# Altium schematic sheet Power.SchDoc
size A; SheetNumber: 1; SheetTotal: 3
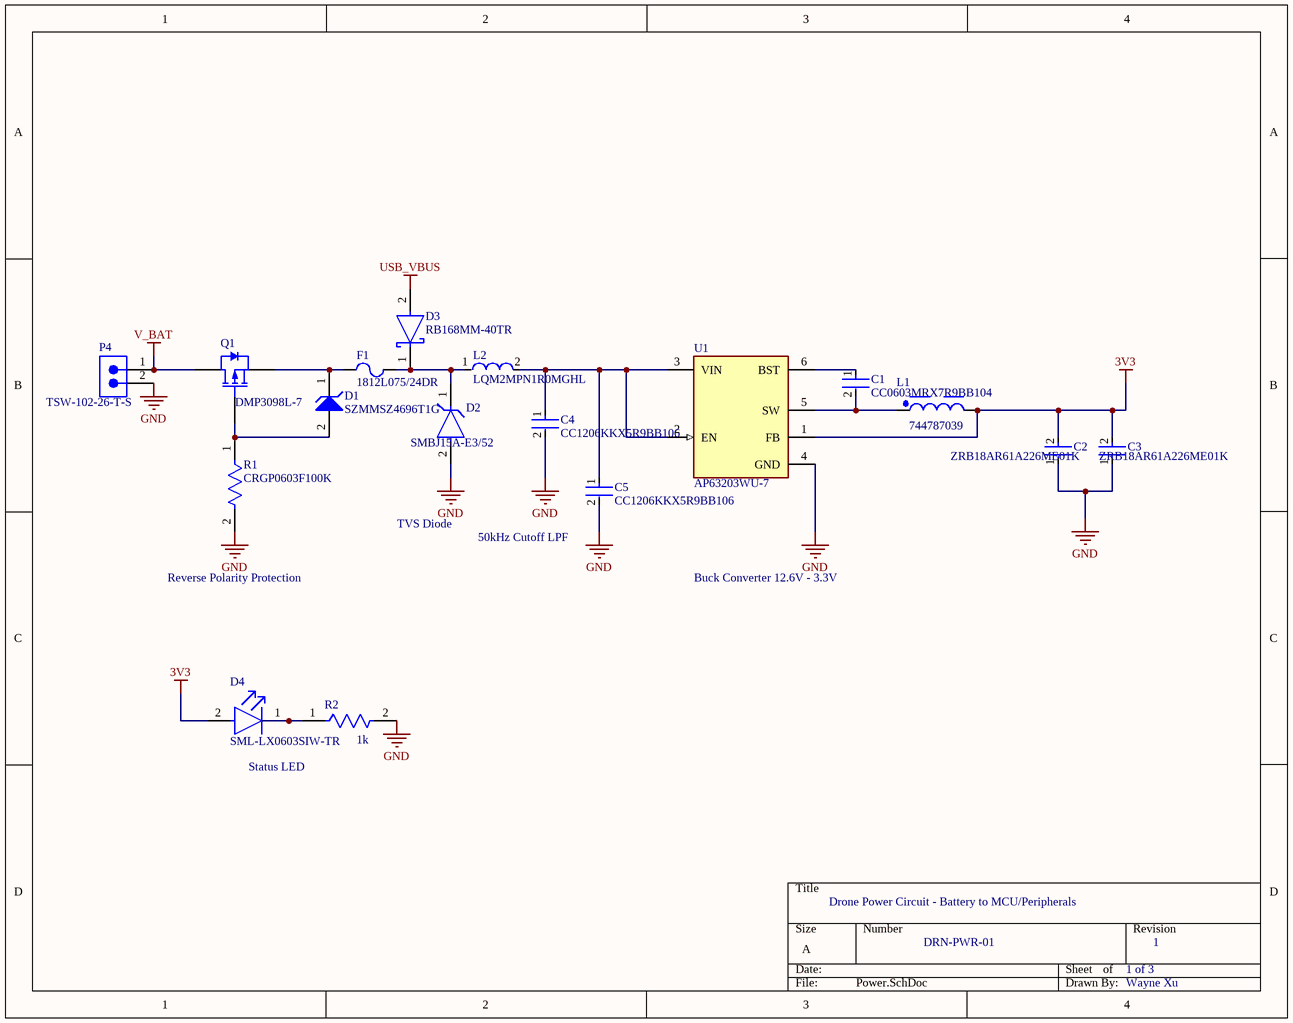
[diagram p0: Power.SchDoc]

## Parts
C1  CC0603MRX7R9BB104  [FP-CC0603-DA-MFG]
C2  ZRB18AR61A226ME01K  [FP-ZRB18A-0_2-MFG]
C3  ZRB18AR61A226ME01K  [FP-ZRB18A-0_2-MFG]
C4  CC1206KKX5R9BB106  [FP-CC1206-FD-MFG]
C5  CC1206KKX5R9BB106  [FP-CC1206-FD-MFG]
D1  SZMMSZ4696T1G  [ONSC-SOD-123-2-425-04_V]
D2  SMBJ15A-E3/52  [FP-95401-MFG]
D3  RB168MM-40TR  [FP-PMDU-MFG]
D4  SML-LX0603SIW-TR  [FP-SML-LX0603SIW-TR-MFG]
F1  1812L075/24DR  [LFUS-1812L07524DR_V]
L1  744787039  [WE-PD2SR_7850]
L2  LQM2MPN1R0MGHL  [FP-LQM2MPN_GH-MFG]
P4  TSW-102-26-T-S  [SMTC-TSW-102-26-XX-S]
Q1  DMP3098L-7  [DIOD-SOT23-3_V]
R1  CRGP0603F100K  [FP-CRGP0603-IPC_C]
R2  1k  [FP-CRGCQ0402-IPC_C]
U1  AP63203WU-7  [FP-TSOT26-MFG]

## Nets
3V3: C2.2 C3.2 D4.2(A) L1.2 U1.1(FB)
GND: C2.1 C3.1 C4.2 C5.2 D2.2(A) P4.2 R1.2 R2.2 U1.4(GND)
USB_VBUS: D3.2(A)
V_BAT: P4.1 Q1.3(D)
NetC1_1: C1.1 U1.6(BST)
NetC1_2: C1.2 L1.1 U1.5(SW)
NetC4_1: C4.1 C5.1 L2.2 U1.2(EN) U1.3(VIN)
NetD1_1: D1.1(K) F1.1 Q1.2(S)
NetD1_2: D1.2(A) Q1.1(G) R1.1
NetD2_1: D2.1(C) D3.1(C) F1.2 L2.1
NetD4_1: D4.1(C) R2.1

## Notes on the sheet
- TVS Diode
- (near C5) 50kHz Cutoff LPF
- Reverse Polarity Protection
- Buck Converter 12.6V - 3.3V
- Status LED
- Drone Power Circuit - Battery to MCU/Peripherals
- DRN-PWR-01
- 1 of 3
- 1
- Wayne Xu

## Library data of the parts
C1 = CMP-03422-000537-1: CAP CER 0.1UF 50V X7R 0603; Manufacturer: YAGEO; Material: Ceramic; Capacitance: 100 nF; Temperature Coefficient: 15%; Tolerance: 0.2; Value: 100 nF; Temperature Range Low: -55°C; Height: 0.9mm; Temperature Range High: +125°C; Category: Cap; Package: CC0603-DA; Mouser Description: Cap Ceramic 50V 20% +Tol 20% -Tol X7R 15% TC 0.1uF SMD 0603; Temperature Characteristic: X7R; Footprint Url: http://www.yageo.com/exep/pages/download/literatures/UPY-C_GEN_24.pdf; Octopart: https://octopart.com/cc0603mrx7r9bb104-yageo-67308423; RoHS: TRUE; Voltage: 50 V; Manufacturer Part Number: CC0603MRX7R9BB104; Lead Free: Yes; ComponentLink2URL: http://www.yageo.com/documents/recent/UPY-GPHC_X7R_6.3V-to-50V_18.pdf; ComponentLink2Description: Datasheet; Digikey Description: CAP CER 0.1UF 50V X7R 0603; Device Class L2: Capacitors; Automotive: No; Voltage Rating: 50 V; Temperature: -55°C to +125°C; Device Class L1: Passive Components; Device Class L3: Ceramic Capacitors
C2 C3 = CMP-06035-026751-1: CAP CER MLCC
C4 C5 = CMP-03422-001420-1: CAP CER 10UF 50V X5R 1206; Tolerance: 10%; Voltage Rating (DC): 50V; Width: 0.063inch; Halogen Free: Halogen Free; Mount: Surface Mount; Dielectric: X5R; Max Operating Temperature: 85°C; Capacitance: 10uF; Case/Package: 1206; Voltage Rating: 50V; Lead Free: Lead Free; Thickness: 0.075inch; Min Operating Temperature: -55°C; Length: 0.126inch; Packaging: Tape and Reel; RoHS Compliant: Yes
D1 = CMP-1060-00433-1: Zener Voltage Regulator, 500 mW, 2-Pin SOD-123, Pb-Free, Tape and Reel; Manufacturer: On Semiconductor; VZ Typ (V): 9.1; P Max (W): 0.5; PartNumber: SZMMSZ4696T1G; PackageVersion: Rev. G, 10/2009; ComponentLink1URL: http://www.onsemi.com/; ComponentLink1Description: Manufacturer URL; PackageDescription: 2-Pin SOD, Body 1.6 x 2.69 mm; ComponentLink2URL: http://www.onsemi.com/pub_link/Collateral/MMSZ4678T1-D.PDF; DatasheetVersion: Rev. 9; Packing: Tape and Reel; PackageReference: SOD-123-2-425-04; ComponentLink3URL: http://www.onsemi.com/pub_link/Collateral/425-04.PDF; ComponentLink2Description: Datasheet; RoHS: Pb-Free; Mounting Technology: Surface Mount; ComponentLink3Description: Package Specification
D2 = CMP-02577-000009-1: TVS DIODE 15V 24.4V DO214AA; Manufacturer: Vishay; Standoff Height: 0mm; Number Of Channels: 1; Max Junction Temp: +150°C; Breakdown Voltage: 16.7V; Peak Pulse Power: 600W; Peak Pulse Current: 24.6A; Direction: Unidirectional; Category: Diode; Reverse Standoff Voltage: 15V; Manufacturer Part Number: SMBJ15A-E3/52; Package: 95401; Temperature: -55°C to +150°C; Automotive: No; ComponentLink2Description: Datasheet; Temperature Range High: +150°C; ComponentLink2URL: https://www.vishay.com/docs/88392/smbj.pdf; Temperature Range Low: -55°C; Digikey Description: TVS DIODE 15V 24.4V DO214AA; Device Class L1: Circuit Protection; Mouser Description: TVS Diodes - Transient Voltage Suppressors 600W 15V 5% Uni; RoHS: TRUE; Device Class L2: TVS Diodes; Footprint Url: https://www.vishay.com/docs/95401/smb.pdf; Clamping Voltage: 24.4V; Octopart: https://octopart.com/smbj15a-e3%2F52-vishay-39558613; Lead Free: Yes; Device Class L3: unset; Height: 2.44mm
D3 = CMP-08971-000002-1: DIODE SCHOTTKY 40V 1A PMDU; Manufacturer: Rohm; Peak Reverse Current: 0.05uA; Max Surge Forward Current: 40A; Max Junction Temp: +150°C; ComponentLink2URL: https://www.rohm.com/datasheet/RB168MM-40/rb168mm-40tr-e; Manufacturer Part Number: RB168MM-40TR; Mouser Description: Schottky Diodes & Rectifiers 40V-VR 1A-IO 30A-IFSM; Reverse Voltage: 40V; Package: PMDU; Forward Current: 1A; Height: 0.9mm; Device Class L1: Discrete Semiconductors; Octopart: https://octopart.com/rb168mm-40tr-rohm-65063949; Digikey Description: DIODE SCHOTTKY 40V 1A PMDU; Lead Free: Yes; Temperature: to +150°C; RoHS: TRUE; Temperature Range High: +150°C; Max Repetitive Reverse Voltage: 40V; Device Class L2: Diodes; Automotive: No; Category: Diode; Device Class L3: Schottky Diodes; ComponentLink2Description: Datasheet
D4 = CMP-57192-000009-1: LED RED DIFFUSED SMD; Test Current: 20mA; Forward Voltage: 2V; Approvals: UL; Dominant Wavelength: 636nm; Viewing Angle: 140°; Lens Color: White; Luminous Intensity: 60mcd; Power Rating: 50mW; Number of LEDs: 1; Color: Red; Forward Current: 20mA; Moisture Sensitivity Level: 2; Case Code (Imperial): 0603; Lead Free: Lead Free; Lens Transparency: Diffused; Case Code (Metric): 1608; Height: 0.6mm; Max Operating Temperature: 85°C; Width: 0.8mm; Lens Style: Diffused; Illumination Color: Red; Wavelength: 636nm; REACH SVHC: No SVHC; Package Quantity: 1; RoHS Compliant: Yes; Case/Package: 0603; Number of Pins: 2; Packaging: Tape and Reel; Length: 1.6mm; Mount: Surface Mount; Min Operating Temperature: -25°C
F1 = CMP-2000-05510-1: Poly-Fuse(R) Resettable PTC, 24 V, 100 A, -40 to 85 degC, 2-Pin SMD, RoHS, Tape and Reel; Manufacturer: Littelfuse; Resistance: 290mOhms; Current Rating - Max: 100A; Maximum Voltage: 24VDC; Hold Current: 0.75A; Trip Current: 1.5A; Maximum Voltage DC: 24V; Type: PolyFuseResettablePTC; Datasheet Version: 02/2016; Package / Case: 1812(4532metric); Mounting Technology: SurfaceMount; Packaging: Reel; Package Description: 2-Pin Surface Mount Device, Body 4.55 x 3.24 mm; Brand: Littelfuse; Manufacturer URL: http://www.littelfuse.com/; Mounting Style: SMD/SMT; Dimensions: 4.37mmLx3.07mmWx0.75mmH; Operating Temperature Range: -40Cto+85C; Product Category: ResettableFuses-PPTC; Current Rating: 100A; Termination Style: SMD/SMT; Factory Pack Quantity: 1500; Current Rating (Max): 100A; Package Reference: 1812L07524DR; RoHS: Details; Series: 1812L; Datasheet URL: http://www.littelfuse.com/~/media/electronics/datasheets/resettable_ptcs/littelfuse_ptc_1812l_datasheet.pdf.pdf
L1 = CMP-1397-00011-3: Fixed Ind 3.9UH 3.8A 20 Mohm SMD; Core Material: Composite, Ferrite; Inductance: 3.9µH; Series Resistance: 16.7mΩ; Tolerance: 30%; Test Frequency: 100kHz; Shielding: Shielded; Self Resonant Frequency: 45MHz; Saturation Current: 4A; Number of Pins: 2; Max Operating Temperature: 125°C; Mount: Surface Mount; Length: 7.8mm; DC Resistance (DCR): 16.7mΩ; Case/Package: SMD/SMT; Min Operating Temperature: -40°C; Width: 7mm; REACH SVHC: Unknown; RMS Current (Irms): 3.8A; Max DC Current: 3.8A; Composition: Wirewound; Termination: SMD/SMT; Inductance Tolerance: 30%; Ambient Temperature Range High: 85°C; Ambient Temperature Range Low: -40°C; Depth: 7mm; Height - Seated (Max): 4.4958mm; RoHS: Compliant; Height: 4.8mm; Current Rating: 3.8A
L2 = CMP-06042-016377-1: FIXED IND 1UH 1.9A 80 MOHM SMD; Self Resonant Frequency: 60MHz; Tolerance: 20%; Shielding: Shielded; Saturation Current: 2A; Core Material: Ferrite; Test Frequency: 1MHz; DC Resistance (DCR): 80mR; Width: 1.6mm; Inductance: 1uH; Case Code (Metric): 2016; Package Quantity: 3000; Lead Free: Contains Lead; Height - Seated (Max): 0.039inch; Max Operating Temperature: 85°C; Height: 0.9mm; RoHS Compliant: Yes; Min Operating Temperature: -40°C; Length: 0.079inch; Case Code (Imperial): 0806; Packaging: Tape and Reel; Mount: Surface Mount; Case/Package: 0806; Max DC Current: 1.9A; Termination: SMD/SMT; Current Rating: 1.9A
P4 = CMP-1024-00328-1: 0.025" SQ Post Header, Through-hole, Vertical, -55 to 105 degC, 2.54 mm Pitch, 2-Pin, Male, RoHS; Manufacturer: Samtec; Pitch: 2.54 mm; PackageReference: TSW-102-26-XX-S; ComponentLink1URL: http://www.samtec.com; ComponentLink3Description: Package Specification; ComponentLink3URL: http://www.samtec.com/documents/webfiles/cpdf/TSW-XXX-XX-XXX-X-XX-XXX-MKT.pdf; DatasheetVersion: F-214; ComponentLink2URL: http://www.samtec.com/documents/webfiles/pdf/TSW_TH.PDF; Mounting Technology: Through-hole; ComponentLink2Description: Datasheet; PartNumber: TSW-102-26-T-S; ComponentLink1Description: Manufacturer URL; PackageDescription: .025[0.64] SQ. Post Terminal Strip Assembly; Orientation: Vertical; PackageVersion: DM, 8/1988; Temperature Range: -55 to 105 degC; RoHS: True
Q1 = CMP-0697-00001-2: P-Channel Enhancement Mode MOSFET, -30 V VDS, -55 to 155 degC, 3-Pin SOT23, RoHS, Tape and Reel; Manufacturer: Diodes Inc; PD (TA: 25 degC)=1.08 W; VGS: +/- 20 V; VDS: -30 V; IDS (TA: 25 degC)=-3.8 A; RDS(on) (Max.) (VGS: 4.5 V)=120 mOhm; VGS(th) (Max.): -2.1 V; ComponentLink3Description: Package Specification; ComponentLink3URL: http://www.diodes.com/datasheets/ap02002.pdf; PackageDescription: 3-Pin Small Outline Transistor, Body 1.3 x 2.9 mm, Pitch 0.95 mm; PackageReference: SOT23; PartNumber: DMP3098L-7; ComponentLink1Description: Manufacturer URL; ComponentLink2Description: Datasheet; ComponentLink2URL: http://www.diodes.com/datasheets/ds31447.pdf; ComponentLink1URL: http://www.diodes.com/; DatasheetVersion: Rev. 8 - 2; Mounting Technology: Surface Mount; RoHS: TRUE; Packing: Tape and Reel; PackageVersion: Rev. 75; Operating Temperature Range: -55 to 150 degC
R1 = CMP-03211-000885-1: CRGP 0603 100K 1%; Manufacturer: TE; Power Rating: 0.25W; Resistance: 100KΩ; Voltage Rating: 50V; Value: 100KΩ; Tolerance: 0.01; Temperature Coefficient: ±100ppm/°C; Device Class L2: Resistors; Temperature: -55°C to +155°C; Temperature Range High: +155°C; Ambient Temperature Range High: +70°C; Lead Free: Yes; RoHS: TRUE; Octopart: https://octopart.com/crgp0603f100k-te+connectivity-91018719; Digikey Description: CRGP 0603 100K 1%; Automotive: No; Manufacturer Part Number: CRGP0603F100K; ComponentLink2Description: Datasheet; Category: Res; Ipc Land Pattern Name: RESC16080X45; Device Class L3: Chip SMD Resistors; Composition: Thick Film; Temperature Range Low: -55°C; Height: 0.55mm; Device Class L1: Passive Components; Series: CRGP; Package: CRGP0603; ComponentLink2URL: https://www.te.com/commerce/DocumentDelivery/DDEController?Action=srchrtrv&DocNm=9-1773463-9&DocType=DS&DocLang=English
R2 = CMP-03211-006314-1: CRGCQ0402 1KΩ 1% ±100ppm/°C 50V; Manufacturer Part Number: CRGCQ0402F1K0; Manufacturer: TE Connectivity; Power Rating: 0.0625W; Tolerance: 0.01; Composition: Thick Film; Voltage Rating: 50V; Device Class L2: Resistors; Package: CRGCQ0402; Temperature Range High: +155°C; Device Class L3: Chip SMD Resistors; Automotive: Yes; Value: 1KΩ; Ambient Temperature Range High: +70°C; Temperature Range Low: -55°C; Temperature: -55°C to +155°C; Resistance: 1KΩ; Device Class L1: Passive Components; Height: 0.4mm; Series: CRGCQ; Lead Free: Yes; ComponentLink2URL: https://www.te.com/commerce/DocumentDelivery/DDEController?Action=showdoc&DocId=Data+Sheet%7F1773204-3%7F1%7Fpdf%7FEnglish%7FENG_DS_1773204-3_1.pdf%7F4-2176347-694; Category: Res; Octopart: https://octopart.com/crgcq0402f1k0-te+connectivity-91017946; RoHS: TRUE; ComponentLink2Description: Datasheet; Ipc Land Pattern Name: RESC10050X35; Temperature Coefficient: ±100ppm/°C
U1 = CMP-12757-000006-1: IC REG BUCK 3.3V 2A TSOT26; Manufacturer: Diodes Inc.; Output Type: Fixed; Min Supply Voltage: 3.8V; Number Of Outputs: 1; Max Junction Temp: +160°C; Nominal Supply Current: 22uA; Standoff Height: 0.01mm; Switching Frequency: 1.1MHz; Max Supply Voltage: 32V; ComponentLink2Description: Datasheet; Device Class L1: Integrated Circuits (ICs); Temperature: to +160°C; Device Class L3: Voltage Regulators - Switching; RoHS: TRUE; Octopart: https://octopart.com/ap63203wu-7-diodes+inc.-98099550; Output Voltage: 3.3V; Lead Free: Yes; ComponentLink2URL: https://www.diodes.com/assets/Datasheets/AP63200-AP63201-AP63203-AP63205.pdf; Digikey Description: IC REG BUCK 3.3V 2A TSOT26; Footprint Url: https://www.diodes.com/assets/Package-Files/TSOT26.pdf; Ambient Temperature Range High: +85°C; Height: 1mm; Automotive: No; Temperature Range High: +160°C; Switching Topology: Buck; Output Current: 2A; Package: TSOT26; Category: IC; Mouser Description: AP63203 Series 3.3 V 2 A SMT Fixed Low IQ Synchronous Buck - TSOT-26; Device Class L2: Power Management ICs; Ambient Temperature Range Low: -40°C; Manufacturer Part Number: AP63203WU-7